# Altium project Placa_Leds_16x16.PrjPcb
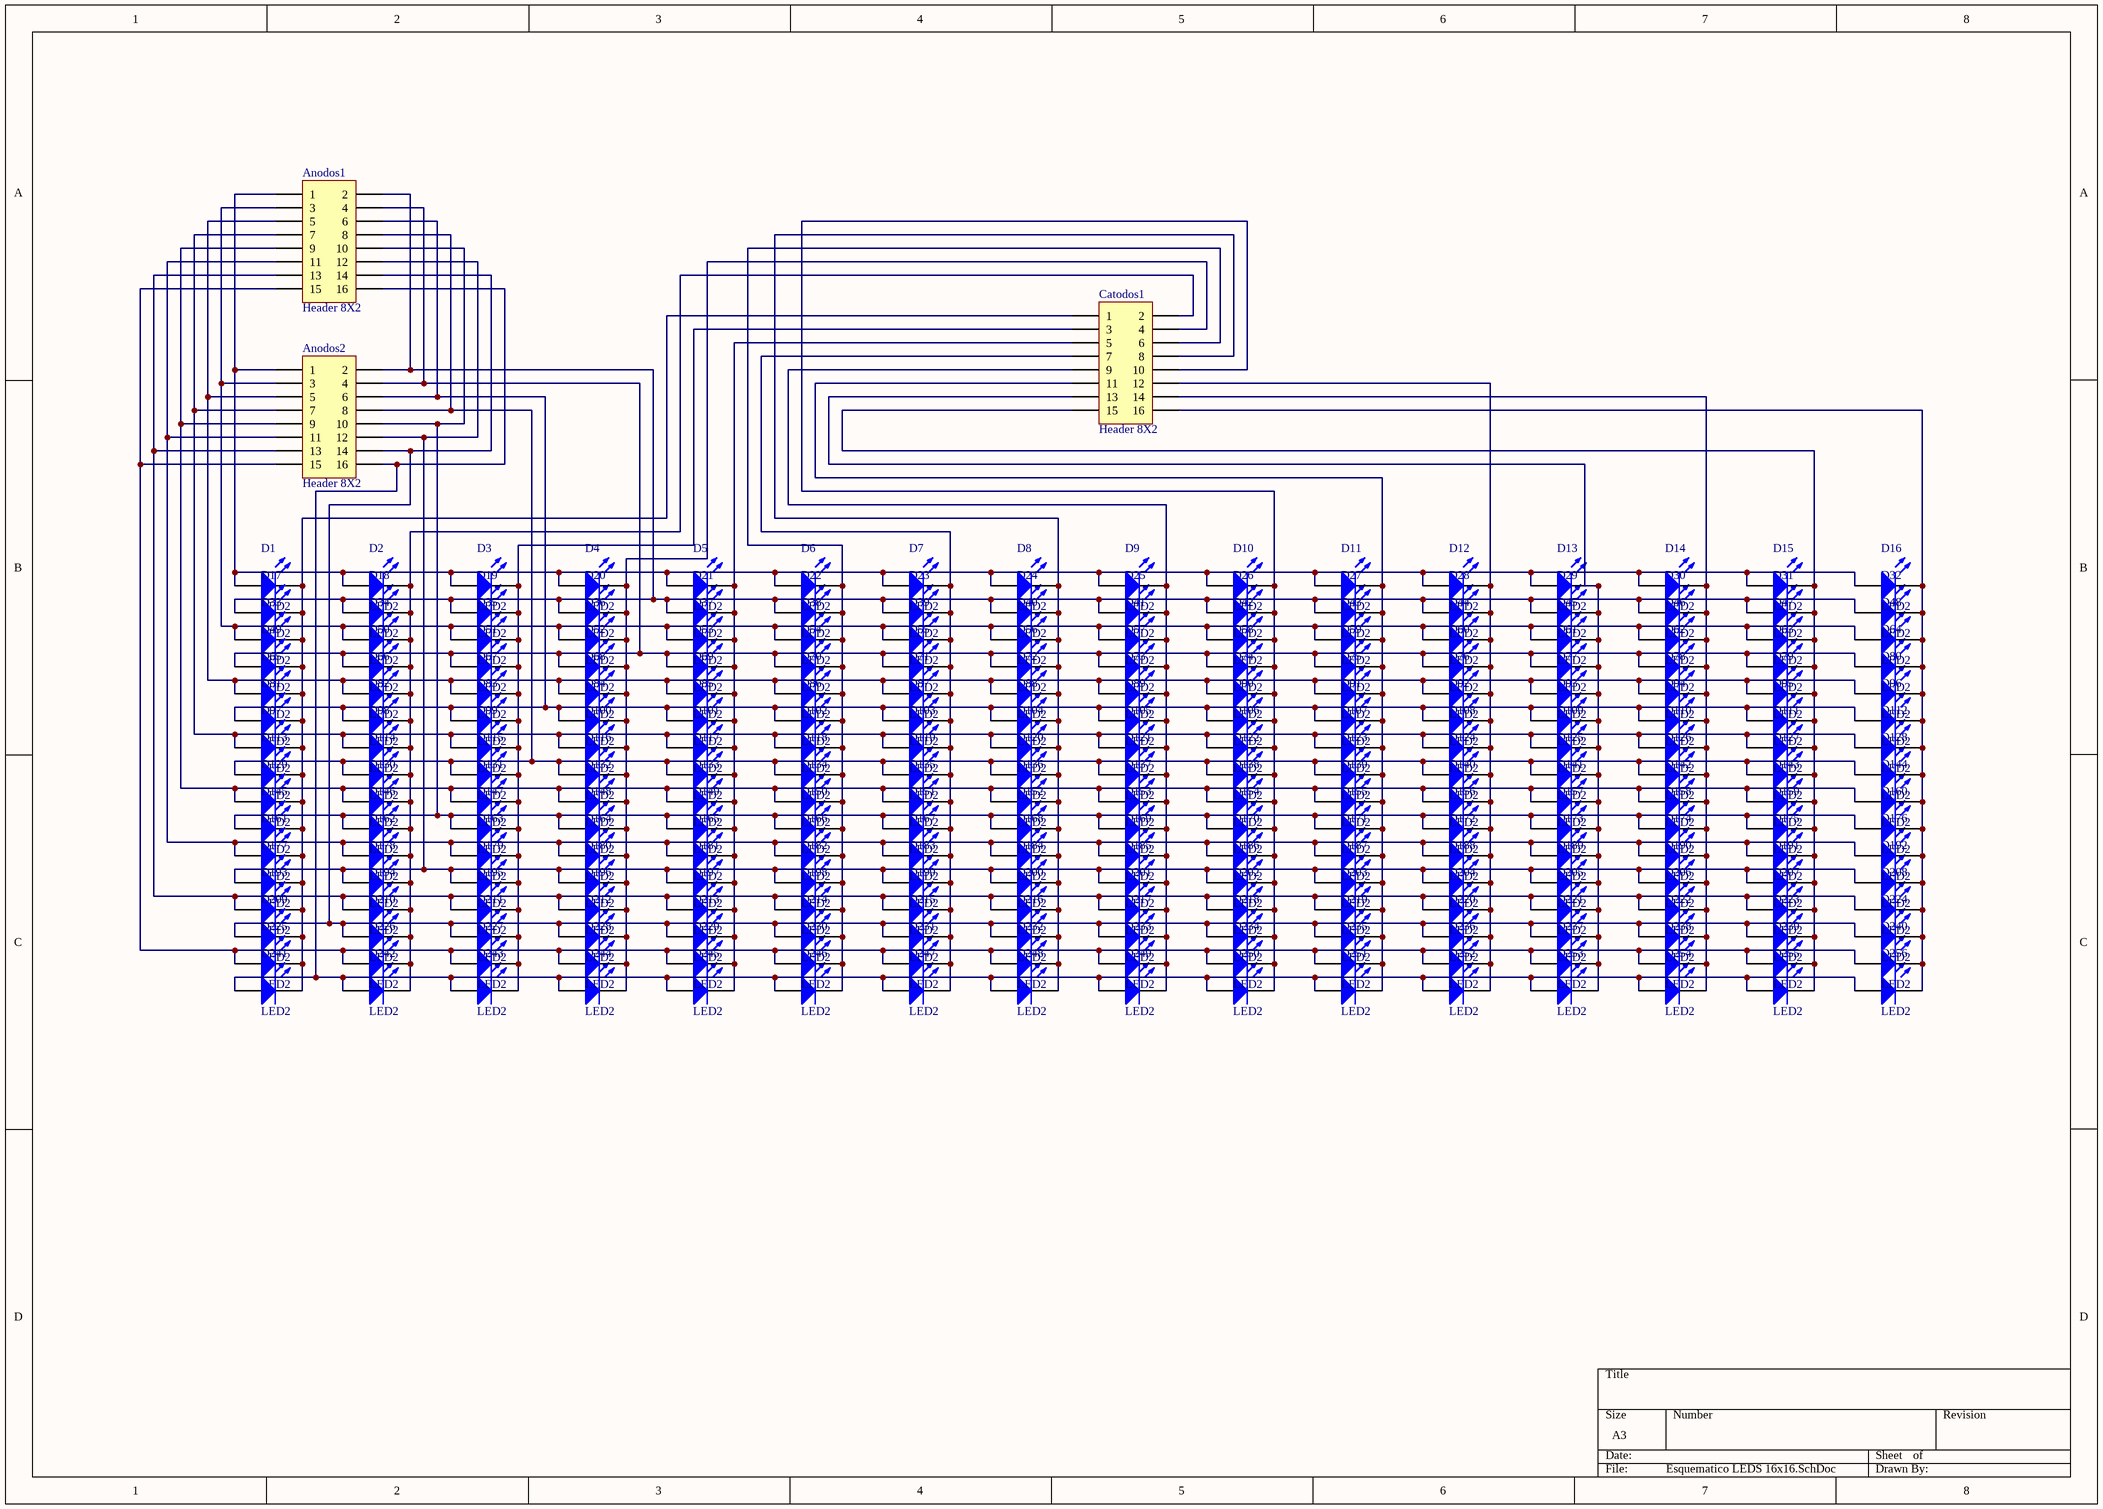
[diagram p0: Esquematico LEDS 16x16.SchDoc]
1 sheet, 259 parts. Net scope: global (net labels, ports and power ports of the same name join across sheets).
Board file: PCB_16x16.PcbDoc

## Sheet Esquematico LEDS 16x16.SchDoc
size A3

### Parts
Anodos1  Header 8X2  [HDR2X8]
Anodos2  Header 8X2  [HDR2X8]
Catodos1  Header 8X2  [HDR2X8]
D1  LED2  [3.2X1.6X1.1]
D2  LED2  [3.2X1.6X1.1]
D3  LED2  [3.2X1.6X1.1]
D4  LED2  [3.2X1.6X1.1]
D5  LED2  [3.2X1.6X1.1]
D6  LED2  [3.2X1.6X1.1]
D7  LED2  [3.2X1.6X1.1]
D8  LED2  [3.2X1.6X1.1]
D9  LED2  [3.2X1.6X1.1]
D10  LED2  [3.2X1.6X1.1]
D11  LED2  [3.2X1.6X1.1]
D12  LED2  [3.2X1.6X1.1]
D13  LED2  [3.2X1.6X1.1]
D14  LED2  [3.2X1.6X1.1]
D15  LED2  [3.2X1.6X1.1]
D16  LED2  [3.2X1.6X1.1]
D17  LED2  [3.2X1.6X1.1]
D18  LED2  [3.2X1.6X1.1]
D19  LED2  [3.2X1.6X1.1]
D20  LED2  [3.2X1.6X1.1]
D21  LED2  [3.2X1.6X1.1]
D22  LED2  [3.2X1.6X1.1]
D23  LED2  [3.2X1.6X1.1]
D24  LED2  [3.2X1.6X1.1]
D25  LED2  [3.2X1.6X1.1]
D26  LED2  [3.2X1.6X1.1]
D27  LED2  [3.2X1.6X1.1]
D28  LED2  [3.2X1.6X1.1]
D29  LED2  [3.2X1.6X1.1]
D30  LED2  [3.2X1.6X1.1]
D31  LED2  [3.2X1.6X1.1]
D32  LED2  [3.2X1.6X1.1]
D33  LED2  [3.2X1.6X1.1]
D34  LED2  [3.2X1.6X1.1]
D35  LED2  [3.2X1.6X1.1]
D36  LED2  [3.2X1.6X1.1]
D37  LED2  [3.2X1.6X1.1]
D38  LED2  [3.2X1.6X1.1]
D39  LED2  [3.2X1.6X1.1]
D40  LED2  [3.2X1.6X1.1]
D41  LED2  [3.2X1.6X1.1]
D42  LED2  [3.2X1.6X1.1]
D43  LED2  [3.2X1.6X1.1]
D44  LED2  [3.2X1.6X1.1]
D45  LED2  [3.2X1.6X1.1]
D46  LED2  [3.2X1.6X1.1]
D47  LED2  [3.2X1.6X1.1]
D48  LED2  [3.2X1.6X1.1]
D49  LED2  [3.2X1.6X1.1]
D50  LED2  [3.2X1.6X1.1]
D51  LED2  [3.2X1.6X1.1]
D52  LED2  [3.2X1.6X1.1]
D53  LED2  [3.2X1.6X1.1]
D54  LED2  [3.2X1.6X1.1]
D55  LED2  [3.2X1.6X1.1]
D56  LED2  [3.2X1.6X1.1]
D57  LED2  [3.2X1.6X1.1]
D58  LED2  [3.2X1.6X1.1]
D59  LED2  [3.2X1.6X1.1]
D60  LED2  [3.2X1.6X1.1]
D61  LED2  [3.2X1.6X1.1]
D62  LED2  [3.2X1.6X1.1]
D63  LED2  [3.2X1.6X1.1]
D64  LED2  [3.2X1.6X1.1]
D65  LED2  [3.2X1.6X1.1]
D66  LED2  [3.2X1.6X1.1]
D67  LED2  [3.2X1.6X1.1]
D68  LED2  [3.2X1.6X1.1]
D69  LED2  [3.2X1.6X1.1]
D70  LED2  [3.2X1.6X1.1]
D71  LED2  [3.2X1.6X1.1]
D72  LED2  [3.2X1.6X1.1]
D73  LED2  [3.2X1.6X1.1]
D74  LED2  [3.2X1.6X1.1]
D75  LED2  [3.2X1.6X1.1]
D76  LED2  [3.2X1.6X1.1]
D77  LED2  [3.2X1.6X1.1]
D78  LED2  [3.2X1.6X1.1]
D79  LED2  [3.2X1.6X1.1]
D80  LED2  [3.2X1.6X1.1]
D81  LED2  [3.2X1.6X1.1]
D82  LED2  [3.2X1.6X1.1]
D83  LED2  [3.2X1.6X1.1]
D84  LED2  [3.2X1.6X1.1]
D85  LED2  [3.2X1.6X1.1]
D86  LED2  [3.2X1.6X1.1]
D87  LED2  [3.2X1.6X1.1]
D88  LED2  [3.2X1.6X1.1]
D89  LED2  [3.2X1.6X1.1]
D90  LED2  [3.2X1.6X1.1]
D91  LED2  [3.2X1.6X1.1]
D92  LED2  [3.2X1.6X1.1]
D93  LED2  [3.2X1.6X1.1]
D94  LED2  [3.2X1.6X1.1]
D95  LED2  [3.2X1.6X1.1]
D96  LED2  [3.2X1.6X1.1]
D97  LED2  [3.2X1.6X1.1]
D98  LED2  [3.2X1.6X1.1]
D99  LED2  [3.2X1.6X1.1]
D100  LED2  [3.2X1.6X1.1]
D101  LED2  [3.2X1.6X1.1]
D102  LED2  [3.2X1.6X1.1]
D103  LED2  [3.2X1.6X1.1]
D104  LED2  [3.2X1.6X1.1]
D105  LED2  [3.2X1.6X1.1]
D106  LED2  [3.2X1.6X1.1]
D107  LED2  [3.2X1.6X1.1]
D108  LED2  [3.2X1.6X1.1]
D109  LED2  [3.2X1.6X1.1]
D110  LED2  [3.2X1.6X1.1]
D111  LED2  [3.2X1.6X1.1]
D112  LED2  [3.2X1.6X1.1]
D113  LED2  [3.2X1.6X1.1]
D114  LED2  [3.2X1.6X1.1]
D115  LED2  [3.2X1.6X1.1]
D116  LED2  [3.2X1.6X1.1]
D117  LED2  [3.2X1.6X1.1]
D118  LED2  [3.2X1.6X1.1]
D119  LED2  [3.2X1.6X1.1]
D120  LED2  [3.2X1.6X1.1]
D121  LED2  [3.2X1.6X1.1]
D122  LED2  [3.2X1.6X1.1]
D123  LED2  [3.2X1.6X1.1]
D124  LED2  [3.2X1.6X1.1]
D125  LED2  [3.2X1.6X1.1]
D126  LED2  [3.2X1.6X1.1]
D127  LED2  [3.2X1.6X1.1]
D128  LED2  [3.2X1.6X1.1]
D129  LED2  [3.2X1.6X1.1]
D130  LED2  [3.2X1.6X1.1]
D131  LED2  [3.2X1.6X1.1]
D132  LED2  [3.2X1.6X1.1]
D133  LED2  [3.2X1.6X1.1]
D134  LED2  [3.2X1.6X1.1]
D135  LED2  [3.2X1.6X1.1]
D136  LED2  [3.2X1.6X1.1]
D137  LED2  [3.2X1.6X1.1]
D138  LED2  [3.2X1.6X1.1]
D139  LED2  [3.2X1.6X1.1]
D140  LED2  [3.2X1.6X1.1]
D141  LED2  [3.2X1.6X1.1]
D142  LED2  [3.2X1.6X1.1]
D143  LED2  [3.2X1.6X1.1]
D144  LED2  [3.2X1.6X1.1]
D145  LED2  [3.2X1.6X1.1]
D146  LED2  [3.2X1.6X1.1]
D147  LED2  [3.2X1.6X1.1]
D148  LED2  [3.2X1.6X1.1]
D149  LED2  [3.2X1.6X1.1]
D150  LED2  [3.2X1.6X1.1]
D151  LED2  [3.2X1.6X1.1]
D152  LED2  [3.2X1.6X1.1]
D153  LED2  [3.2X1.6X1.1]
D154  LED2  [3.2X1.6X1.1]
D155  LED2  [3.2X1.6X1.1]
D156  LED2  [3.2X1.6X1.1]
D157  LED2  [3.2X1.6X1.1]
D158  LED2  [3.2X1.6X1.1]
D159  LED2  [3.2X1.6X1.1]
D160  LED2  [3.2X1.6X1.1]
D161  LED2  [3.2X1.6X1.1]
D162  LED2  [3.2X1.6X1.1]
D163  LED2  [3.2X1.6X1.1]
D164  LED2  [3.2X1.6X1.1]
D165  LED2  [3.2X1.6X1.1]
D166  LED2  [3.2X1.6X1.1]
D167  LED2  [3.2X1.6X1.1]
D168  LED2  [3.2X1.6X1.1]
D169  LED2  [3.2X1.6X1.1]
D170  LED2  [3.2X1.6X1.1]
D171  LED2  [3.2X1.6X1.1]
D172  LED2  [3.2X1.6X1.1]
D173  LED2  [3.2X1.6X1.1]
D174  LED2  [3.2X1.6X1.1]
D175  LED2  [3.2X1.6X1.1]
D176  LED2  [3.2X1.6X1.1]
D177  LED2  [3.2X1.6X1.1]
D178  LED2  [3.2X1.6X1.1]
D179  LED2  [3.2X1.6X1.1]
D180  LED2  [3.2X1.6X1.1]
D181  LED2  [3.2X1.6X1.1]
D182  LED2  [3.2X1.6X1.1]
D183  LED2  [3.2X1.6X1.1]
D184  LED2  [3.2X1.6X1.1]
D185  LED2  [3.2X1.6X1.1]
D186  LED2  [3.2X1.6X1.1]
D187  LED2  [3.2X1.6X1.1]
D188  LED2  [3.2X1.6X1.1]
D189  LED2  [3.2X1.6X1.1]
D190  LED2  [3.2X1.6X1.1]
D191  LED2  [3.2X1.6X1.1]
D192  LED2  [3.2X1.6X1.1]
D193  LED2  [3.2X1.6X1.1]
D194  LED2  [3.2X1.6X1.1]
D195  LED2  [3.2X1.6X1.1]
D196  LED2  [3.2X1.6X1.1]
D197  LED2  [3.2X1.6X1.1]
D198  LED2  [3.2X1.6X1.1]
D199  LED2  [3.2X1.6X1.1]
D200  LED2  [3.2X1.6X1.1]
D201  LED2  [3.2X1.6X1.1]
D202  LED2  [3.2X1.6X1.1]
D203  LED2  [3.2X1.6X1.1]
D204  LED2  [3.2X1.6X1.1]
D205  LED2  [3.2X1.6X1.1]
D206  LED2  [3.2X1.6X1.1]
D207  LED2  [3.2X1.6X1.1]
D208  LED2  [3.2X1.6X1.1]
D209  LED2  [3.2X1.6X1.1]
D210  LED2  [3.2X1.6X1.1]
D211  LED2  [3.2X1.6X1.1]
D212  LED2  [3.2X1.6X1.1]
D213  LED2  [3.2X1.6X1.1]
D214  LED2  [3.2X1.6X1.1]
D215  LED2  [3.2X1.6X1.1]
D216  LED2  [3.2X1.6X1.1]
D217  LED2  [3.2X1.6X1.1]
D218  LED2  [3.2X1.6X1.1]
D219  LED2  [3.2X1.6X1.1]
D220  LED2  [3.2X1.6X1.1]
D221  LED2  [3.2X1.6X1.1]
D222  LED2  [3.2X1.6X1.1]
D223  LED2  [3.2X1.6X1.1]
D224  LED2  [3.2X1.6X1.1]
D225  LED2  [3.2X1.6X1.1]
D226  LED2  [3.2X1.6X1.1]
D227  LED2  [3.2X1.6X1.1]
D228  LED2  [3.2X1.6X1.1]
D229  LED2  [3.2X1.6X1.1]
D230  LED2  [3.2X1.6X1.1]
D231  LED2  [3.2X1.6X1.1]
D232  LED2  [3.2X1.6X1.1]
D233  LED2  [3.2X1.6X1.1]
D234  LED2  [3.2X1.6X1.1]
D235  LED2  [3.2X1.6X1.1]
D236  LED2  [3.2X1.6X1.1]
D237  LED2  [3.2X1.6X1.1]
D238  LED2  [3.2X1.6X1.1]
D239  LED2  [3.2X1.6X1.1]
D240  LED2  [3.2X1.6X1.1]
D241  LED2  [3.2X1.6X1.1]
D242  LED2  [3.2X1.6X1.1]
D243  LED2  [3.2X1.6X1.1]
D244  LED2  [3.2X1.6X1.1]
D245  LED2  [3.2X1.6X1.1]
D246  LED2  [3.2X1.6X1.1]
D247  LED2  [3.2X1.6X1.1]
D248  LED2  [3.2X1.6X1.1]
D249  LED2  [3.2X1.6X1.1]
D250  LED2  [3.2X1.6X1.1]
D251  LED2  [3.2X1.6X1.1]
D252  LED2  [3.2X1.6X1.1]
D253  LED2  [3.2X1.6X1.1]
D254  LED2  [3.2X1.6X1.1]
D255  LED2  [3.2X1.6X1.1]
D256  LED2  [3.2X1.6X1.1]

### Nets
NetAnodos1_1: Anodos1.1 Anodos2.1 D1.1(A) D2.1(A) D3.1(A) D4.1(A) D5.1(A) D6.1(A) D7.1(A) D8.1(A) D9.1(A) D10.1(A) D11.1(A) D12.1(A) D13.1(A) D14.1(A) D15.1(A) D16.1(A)
NetAnodos1_2: Anodos1.2 Anodos2.2 D17.1(A) D18.1(A) D19.1(A) D20.1(A) D21.1(A) D22.1(A) D23.1(A) D24.1(A) D25.1(A) D26.1(A) D27.1(A) D28.1(A) D29.1(A) D30.1(A) D31.1(A) D32.1(A)
NetAnodos1_3: Anodos1.3 Anodos2.3 D33.1(A) D34.1(A) D35.1(A) D36.1(A) D37.1(A) D38.1(A) D39.1(A) D40.1(A) D41.1(A) D42.1(A) D43.1(A) D44.1(A) D45.1(A) D46.1(A) D47.1(A) D48.1(A)
NetAnodos1_4: Anodos1.4 Anodos2.4 D49.1(A) D50.1(A) D51.1(A) D52.1(A) D53.1(A) D54.1(A) D55.1(A) D56.1(A) D57.1(A) D58.1(A) D59.1(A) D60.1(A) D61.1(A) D62.1(A) D63.1(A) D64.1(A)
NetAnodos1_5: Anodos1.5 Anodos2.5 D65.1(A) D66.1(A) D67.1(A) D68.1(A) D69.1(A) D70.1(A) D71.1(A) D72.1(A) D73.1(A) D74.1(A) D75.1(A) D76.1(A) D77.1(A) D78.1(A) D79.1(A) D80.1(A)
NetAnodos1_6: Anodos1.6 Anodos2.6 D81.1(A) D82.1(A) D83.1(A) D84.1(A) D85.1(A) D86.1(A) D87.1(A) D88.1(A) D89.1(A) D90.1(A) D91.1(A) D92.1(A) D93.1(A) D94.1(A) D95.1(A) D96.1(A)
NetAnodos1_7: Anodos1.7 Anodos2.7 D97.1(A) D98.1(A) D99.1(A) D100.1(A) D101.1(A) D102.1(A) D103.1(A) D104.1(A) D105.1(A) D106.1(A) D107.1(A) D108.1(A) D109.1(A) D110.1(A) D111.1(A) D112.1(A)
NetAnodos1_8: Anodos1.8 Anodos2.8 D113.1(A) D114.1(A) D115.1(A) D116.1(A) D117.1(A) D118.1(A) D119.1(A) D120.1(A) D121.1(A) D122.1(A) D123.1(A) D124.1(A) D125.1(A) D126.1(A) D127.1(A) D128.1(A)
NetAnodos1_9: Anodos1.9 Anodos2.9 D129.1(A) D130.1(A) D131.1(A) D132.1(A) D133.1(A) D134.1(A) D135.1(A) D136.1(A) D137.1(A) D138.1(A) D139.1(A) D140.1(A) D141.1(A) D142.1(A) D143.1(A) D144.1(A)
NetAnodos1_10: Anodos1.10 Anodos2.10 D145.1(A) D146.1(A) D147.1(A) D148.1(A) D149.1(A) D150.1(A) D151.1(A) D152.1(A) D153.1(A) D154.1(A) D155.1(A) D156.1(A) D157.1(A) D158.1(A) D159.1(A) D160.1(A)
NetAnodos1_11: Anodos1.11 Anodos2.11 D161.1(A) D162.1(A) D163.1(A) D164.1(A) D165.1(A) D166.1(A) D167.1(A) D168.1(A) D169.1(A) D170.1(A) D171.1(A) D172.1(A) D173.1(A) D174.1(A) D175.1(A) D176.1(A)
NetAnodos1_12: Anodos1.12 Anodos2.12 D177.1(A) D178.1(A) D179.1(A) D180.1(A) D181.1(A) D182.1(A) D183.1(A) D184.1(A) D185.1(A) D186.1(A) D187.1(A) D188.1(A) D189.1(A) D190.1(A) D191.1(A) D192.1(A)
NetAnodos1_13: Anodos1.13 Anodos2.13 D193.1(A) D194.1(A) D195.1(A) D196.1(A) D197.1(A) D198.1(A) D199.1(A) D200.1(A) D201.1(A) D202.1(A) D203.1(A) D204.1(A) D205.1(A) D206.1(A) D207.1(A) D208.1(A)
NetAnodos1_14: Anodos1.14 Anodos2.14 D209.1(A) D210.1(A) D211.1(A) D212.1(A) D213.1(A) D214.1(A) D215.1(A) D216.1(A) D217.1(A) D218.1(A) D219.1(A) D220.1(A) D221.1(A) D222.1(A) D223.1(A) D224.1(A)
NetAnodos1_15: Anodos1.15 Anodos2.15 D225.1(A) D226.1(A) D227.1(A) D228.1(A) D229.1(A) D230.1(A) D231.1(A) D232.1(A) D233.1(A) D234.1(A) D235.1(A) D236.1(A) D237.1(A) D238.1(A) D239.1(A) D240.1(A)
NetAnodos1_16: Anodos1.16 Anodos2.16 D241.1(A) D242.1(A) D243.1(A) D244.1(A) D245.1(A) D246.1(A) D247.1(A) D248.1(A) D249.1(A) D250.1(A) D251.1(A) D252.1(A) D253.1(A) D254.1(A) D255.1(A) D256.1(A)
NetCatodos1_1: Catodos1.1 D1.2(K) D17.2(K) D33.2(K) D49.2(K) D65.2(K) D81.2(K) D97.2(K) D113.2(K) D129.2(K) D145.2(K) D161.2(K) D177.2(K) D193.2(K) D209.2(K) D225.2(K) D241.2(K)
NetCatodos1_2: Catodos1.2 D2.2(K) D18.2(K) D34.2(K) D50.2(K) D66.2(K) D82.2(K) D98.2(K) D114.2(K) D130.2(K) D146.2(K) D162.2(K) D178.2(K) D194.2(K) D210.2(K) D226.2(K) D242.2(K)
NetCatodos1_3: Catodos1.3 D3.2(K) D19.2(K) D35.2(K) D51.2(K) D67.2(K) D83.2(K) D99.2(K) D115.2(K) D131.2(K) D147.2(K) D163.2(K) D179.2(K) D195.2(K) D211.2(K) D227.2(K) D243.2(K)
NetCatodos1_4: Catodos1.4 D4.2(K) D20.2(K) D36.2(K) D52.2(K) D68.2(K) D84.2(K) D100.2(K) D116.2(K) D132.2(K) D148.2(K) D164.2(K) D180.2(K) D196.2(K) D212.2(K) D228.2(K) D244.2(K)
NetCatodos1_5: Catodos1.5 D5.2(K) D21.2(K) D37.2(K) D53.2(K) D69.2(K) D85.2(K) D101.2(K) D117.2(K) D133.2(K) D149.2(K) D165.2(K) D181.2(K) D197.2(K) D213.2(K) D229.2(K) D245.2(K)
NetCatodos1_6: Catodos1.6 D6.2(K) D22.2(K) D38.2(K) D54.2(K) D70.2(K) D86.2(K) D102.2(K) D118.2(K) D134.2(K) D150.2(K) D166.2(K) D182.2(K) D198.2(K) D214.2(K) D230.2(K) D246.2(K)
NetCatodos1_7: Catodos1.7 D7.2(K) D23.2(K) D39.2(K) D55.2(K) D71.2(K) D87.2(K) D103.2(K) D119.2(K) D135.2(K) D151.2(K) D167.2(K) D183.2(K) D199.2(K) D215.2(K) D231.2(K) D247.2(K)
NetCatodos1_8: Catodos1.8 D8.2(K) D24.2(K) D40.2(K) D56.2(K) D72.2(K) D88.2(K) D104.2(K) D120.2(K) D136.2(K) D152.2(K) D168.2(K) D184.2(K) D200.2(K) D216.2(K) D232.2(K) D248.2(K)
NetCatodos1_9: Catodos1.9 D9.2(K) D25.2(K) D41.2(K) D57.2(K) D73.2(K) D89.2(K) D105.2(K) D121.2(K) D137.2(K) D153.2(K) D169.2(K) D185.2(K) D201.2(K) D217.2(K) D233.2(K) D249.2(K)
NetCatodos1_10: Catodos1.10 D10.2(K) D26.2(K) D42.2(K) D58.2(K) D74.2(K) D90.2(K) D106.2(K) D122.2(K) D138.2(K) D154.2(K) D170.2(K) D186.2(K) D202.2(K) D218.2(K) D234.2(K) D250.2(K)
NetCatodos1_11: Catodos1.11 D11.2(K) D27.2(K) D43.2(K) D59.2(K) D75.2(K) D91.2(K) D107.2(K) D123.2(K) D139.2(K) D155.2(K) D171.2(K) D187.2(K) D203.2(K) D219.2(K) D235.2(K) D251.2(K)
NetCatodos1_12: Catodos1.12 D12.2(K) D28.2(K) D44.2(K) D60.2(K) D76.2(K) D92.2(K) D108.2(K) D124.2(K) D140.2(K) D156.2(K) D172.2(K) D188.2(K) D204.2(K) D220.2(K) D236.2(K) D252.2(K)
NetCatodos1_13: Catodos1.13 D13.2(K) D29.2(K) D45.2(K) D61.2(K) D77.2(K) D93.2(K) D109.2(K) D125.2(K) D141.2(K) D157.2(K) D173.2(K) D189.2(K) D205.2(K) D221.2(K) D237.2(K) D253.2(K)
NetCatodos1_14: Catodos1.14 D14.2(K) D30.2(K) D46.2(K) D62.2(K) D78.2(K) D94.2(K) D110.2(K) D126.2(K) D142.2(K) D158.2(K) D174.2(K) D190.2(K) D206.2(K) D222.2(K) D238.2(K) D254.2(K)
NetCatodos1_15: Catodos1.15 D15.2(K) D31.2(K) D47.2(K) D63.2(K) D79.2(K) D95.2(K) D111.2(K) D127.2(K) D143.2(K) D159.2(K) D175.2(K) D191.2(K) D207.2(K) D223.2(K) D239.2(K) D255.2(K)
NetCatodos1_16: Catodos1.16 D16.2(K) D32.2(K) D48.2(K) D64.2(K) D80.2(K) D96.2(K) D112.2(K) D128.2(K) D144.2(K) D160.2(K) D176.2(K) D192.2(K) D208.2(K) D224.2(K) D240.2(K) D256.2(K)

### Library data of the parts
Anodos1 Anodos2 Catodos1 = Header 8X2: Header, 8-Pin, Dual row; LatestRevisionDate: 17-Jul-2002; LatestRevisionNote: Re-released for DXP Platform.; Publisher: Altium Limited
D1-D256 = LED2: Typical RED, GREEN, YELLOW, AMBER GaAs LED; Published: 8-Jun-2000; LatestRevisionDate: 17-Jul-2002; LatestRevisionNote: Re-released for DXP Platform.; PackageVersion: Feb-2002; PackageReference: 3.2X1.6X1.1; Publisher: Altium Limited; PackageDescription: SM LED; 2 Flat Leads